# Altium schematic sheet uc.SchDoc
size A4
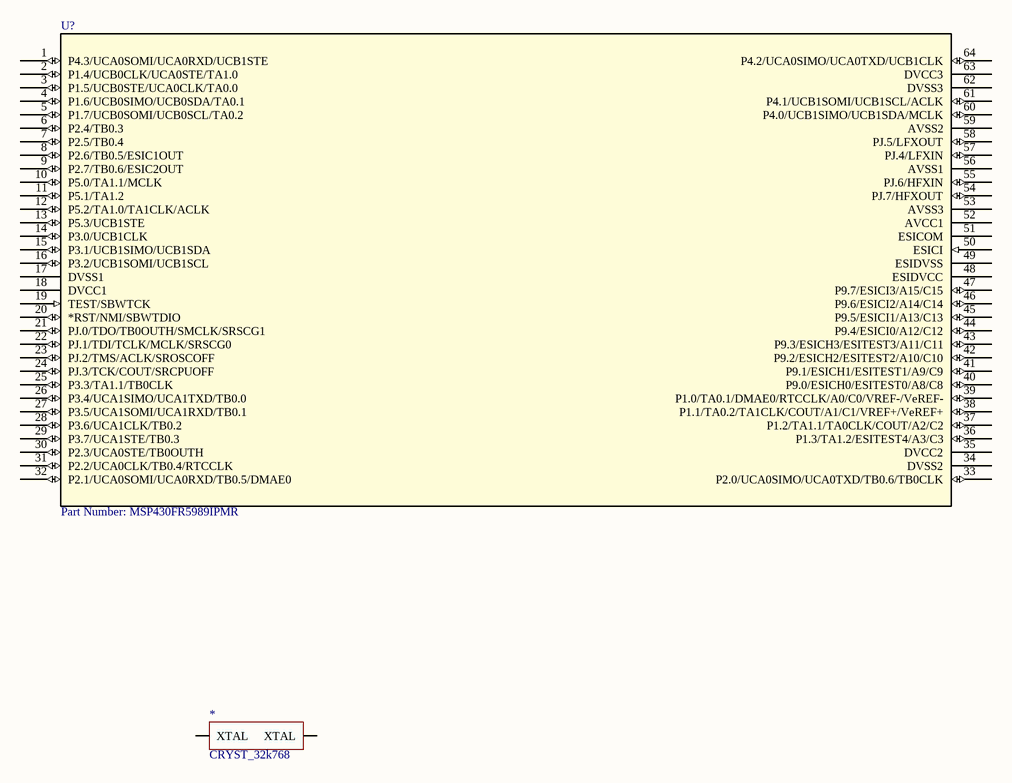
[diagram p0: uc.SchDoc]

## Parts
*  CRYST_32k768  [CRYST 32.768 kHz]
U?  Part Number: MSP430FR5989IPMR  [PM64]

## Nets

Not connected (* = marked no-connect by the designer): * 1(XTAL) 2(XTAL); U? 1(P4.3/UCA0SOMI/UCA0RXD/UCB1STE) 2(P1.4/UCB0CLK/UCA0STE/TA1.0) 3(P1.5/UCB0STE/UCA0CLK/TA0.0) 4(P1.6/UCB0SIMO/UCB0SDA/TA0.1) 5(P1.7/UCB0SOMI/UCB0SCL/TA0.2) 6(P2.4/TB0.3) 7(P2.5/TB0.4) 8(P2.6/TB0.5/ESIC1OUT) 9(P2.7/TB0.6/ESIC2OUT) 10(P5.0/TA1.1/MCLK) 11(P5.1/TA1.2) 12(P5.2/TA1.0/TA1CLK/ACLK) 13(P5.3/UCB1STE) 14(P3.0/UCB1CLK) 15(P3.1/UCB1SIMO/UCB1SDA) 16(P3.2/UCB1SOMI/UCB1SCL) 17(DVSS1) 18(DVCC1) 19(TEST/SBWTCK) 20(*RST/NMI/SBWTDIO) 21(PJ.0/TDO/TB0OUTH/SMCLK/SRSCG1) 22(PJ.1/TDI/TCLK/MCLK/SRSCG0) 23(PJ.2/TMS/ACLK/SROSCOFF) 24(PJ.3/TCK/COUT/SRCPUOFF) 25(P3.3/TA1.1/TB0CLK) 26(P3.4/UCA1SIMO/UCA1TXD/TB0.0) 27(P3.5/UCA1SOMI/UCA1RXD/TB0.1) 28(P3.6/UCA1CLK/TB0.2) 29(P3.7/UCA1STE/TB0.3) 30(P2.3/UCA0STE/TB0OUTH) 31(P2.2/UCA0CLK/TB0.4/RTCCLK) 32(P2.1/UCA0SOMI/UCA0RXD/TB0.5/DMAE0) 33(P2.0/UCA0SIMO/UCA0TXD/TB0.6/TB0CLK) 34(DVSS2) 35(DVCC2) 36(P1.3/TA1.2/ESITEST4/A3/C3) 37(P1.2/TA1.1/TA0CLK/COUT/A2/C2) 38(P1.1/TA0.2/TA1CLK/COUT/A1/C1/VREF+/VeREF+) 39(P1.0/TA0.1/DMAE0/RTCCLK/A0/C0/VREF-/VeREF-) 40(P9.0/ESICH0/ESITEST0/A8/C8) 41(P9.1/ESICH1/ESITEST1/A9/C9) 42(P9.2/ESICH2/ESITEST2/A10/C10) 43(P9.3/ESICH3/ESITEST3/A11/C11) 44(P9.4/ESICI0/A12/C12) 45(P9.5/ESICI1/A13/C13) 46(P9.6/ESICI2/A14/C14) 47(P9.7/ESICI3/A15/C15) 48(ESIDVCC) 49(ESIDVSS) 50(ESICI) 51(ESICOM) 52(AVCC1) 53(AVSS3) 54(PJ.7/HFXOUT) 55(PJ.6/HFXIN) 56(AVSS1) 57(PJ.4/LFXIN) 58(PJ.5/LFXOUT) 59(AVSS2) 60(P4.0/UCB1SIMO/UCB1SDA/MCLK) 61(P4.1/UCB1SOMI/UCB1SCL/ACLK) 62(DVSS3) 63(DVCC3) 64(P4.2/UCA0SIMO/UCA0TXD/UCB1CLK)

## Library data of the parts
U? = MSP430FR5989IPMR: No Description Available; Vendor: Texas Instruments; Built_By: EMA_UL_Team; Manufacturer_Part_Number: MSP430FR5989IPMR; Copyright: Copyright (C) 2018 Accelerated Designs. All rights reserved; RefDes: RefDes; Type: DEV; Value: Value